# EAGLE design CNY70 (EAGLE 6.5.0)
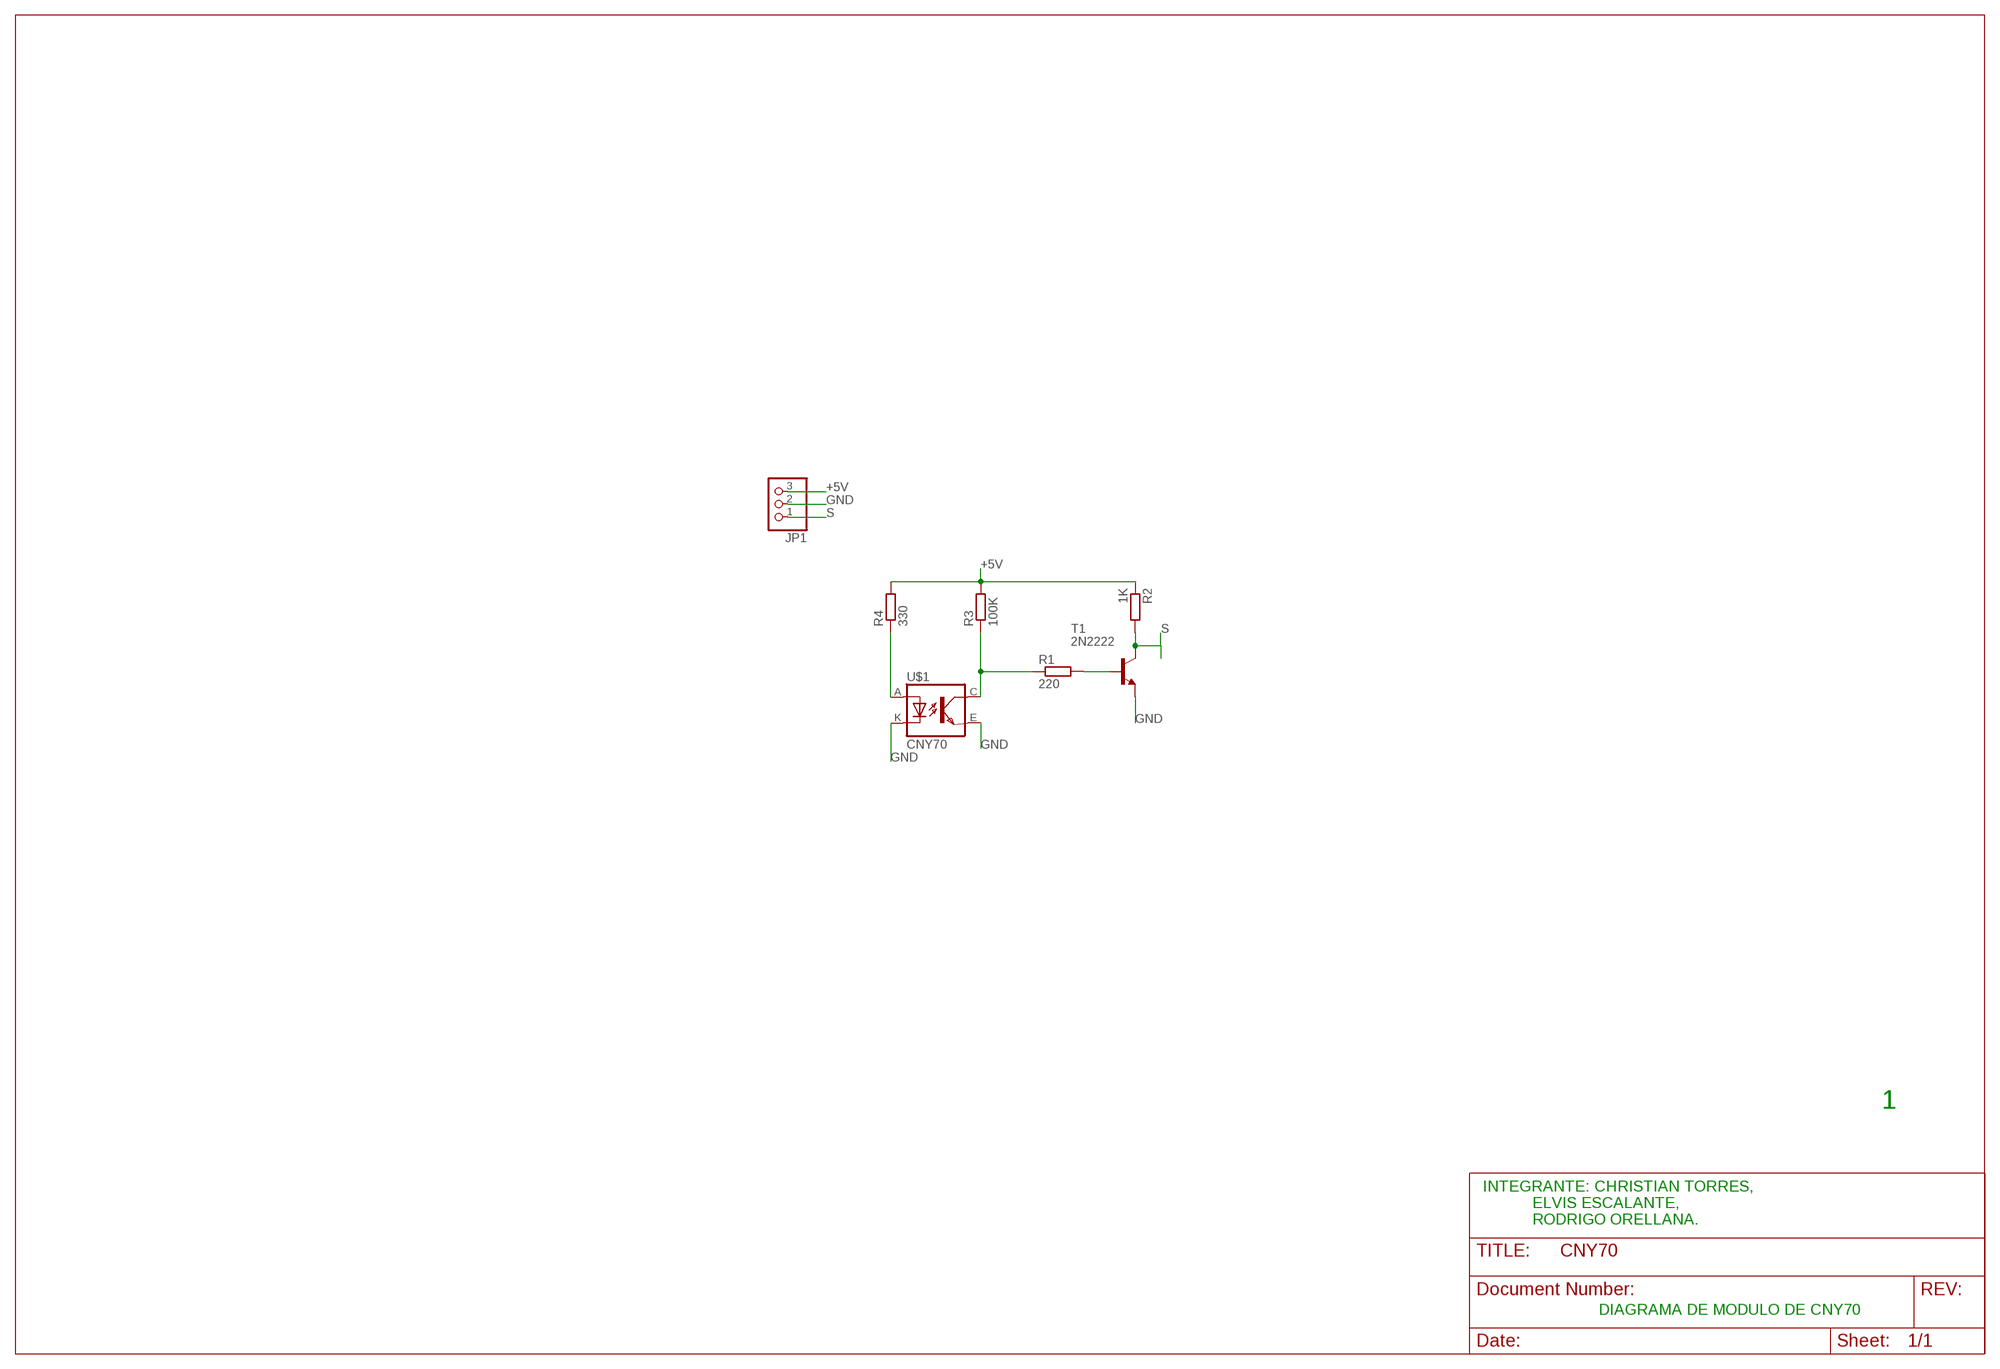
[diagram p0: schematic, sheet 1]

## Parts
JP1  PINHD-1X3  [1X03]
R1  220  R-EU_0207/12  [0207/12]
R2  1K  R-EU_0207/12  [0207/12]
R3  100K  R-EU_0207/12  [0207/12]
R4  330  R-EU_0207/12  [0207/12]
T1  2N2222  [TO92]
U$1  CNY70  [4]

## Nets
+5V: JP1.3 R2.1 R3.2 R4.2
GND: JP1.2 T1.3(E) U$1.E(EMI) U$1.K(C)
N$1: R4.1 U$1.A
N$2: R1.1 R3.1 U$1.C(COL)
N$3: R1.2 T1.1(B)
S: JP1.1 R2.2 T1.2(C)

## Notes on the sheet
- 1
- INTEGRANTE: CHRISTIAN TORRES, 
             ELVIS ESCALANTE,
             RODRIGO ORELLANA.
- DIAGRAMA DE MODULO DE CNY70

## Library data of the parts
JP1 = pinhead:PINHD-1X3: PIN HEADER
R1-R4 = rcl:R-EU_: RESISTOR, European symbol
T1 = transistor-neu92:2N2222: NPN TRANSISTOR
U$1 = cny70:CNY70

## Board
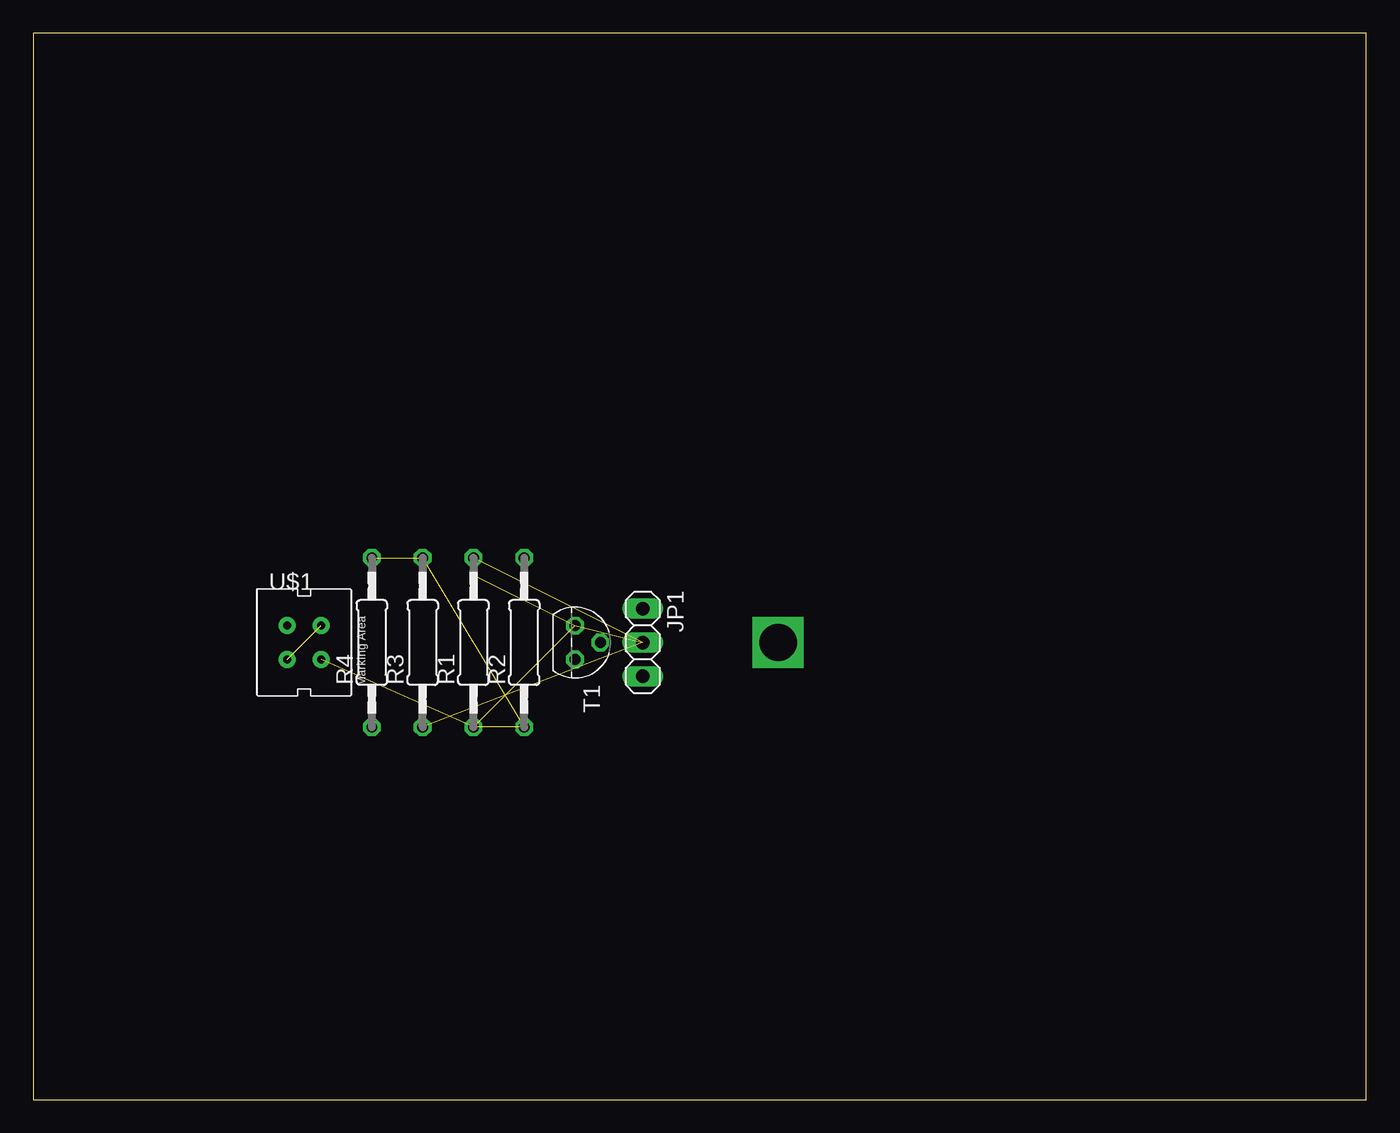
[diagram p1: board, top side]
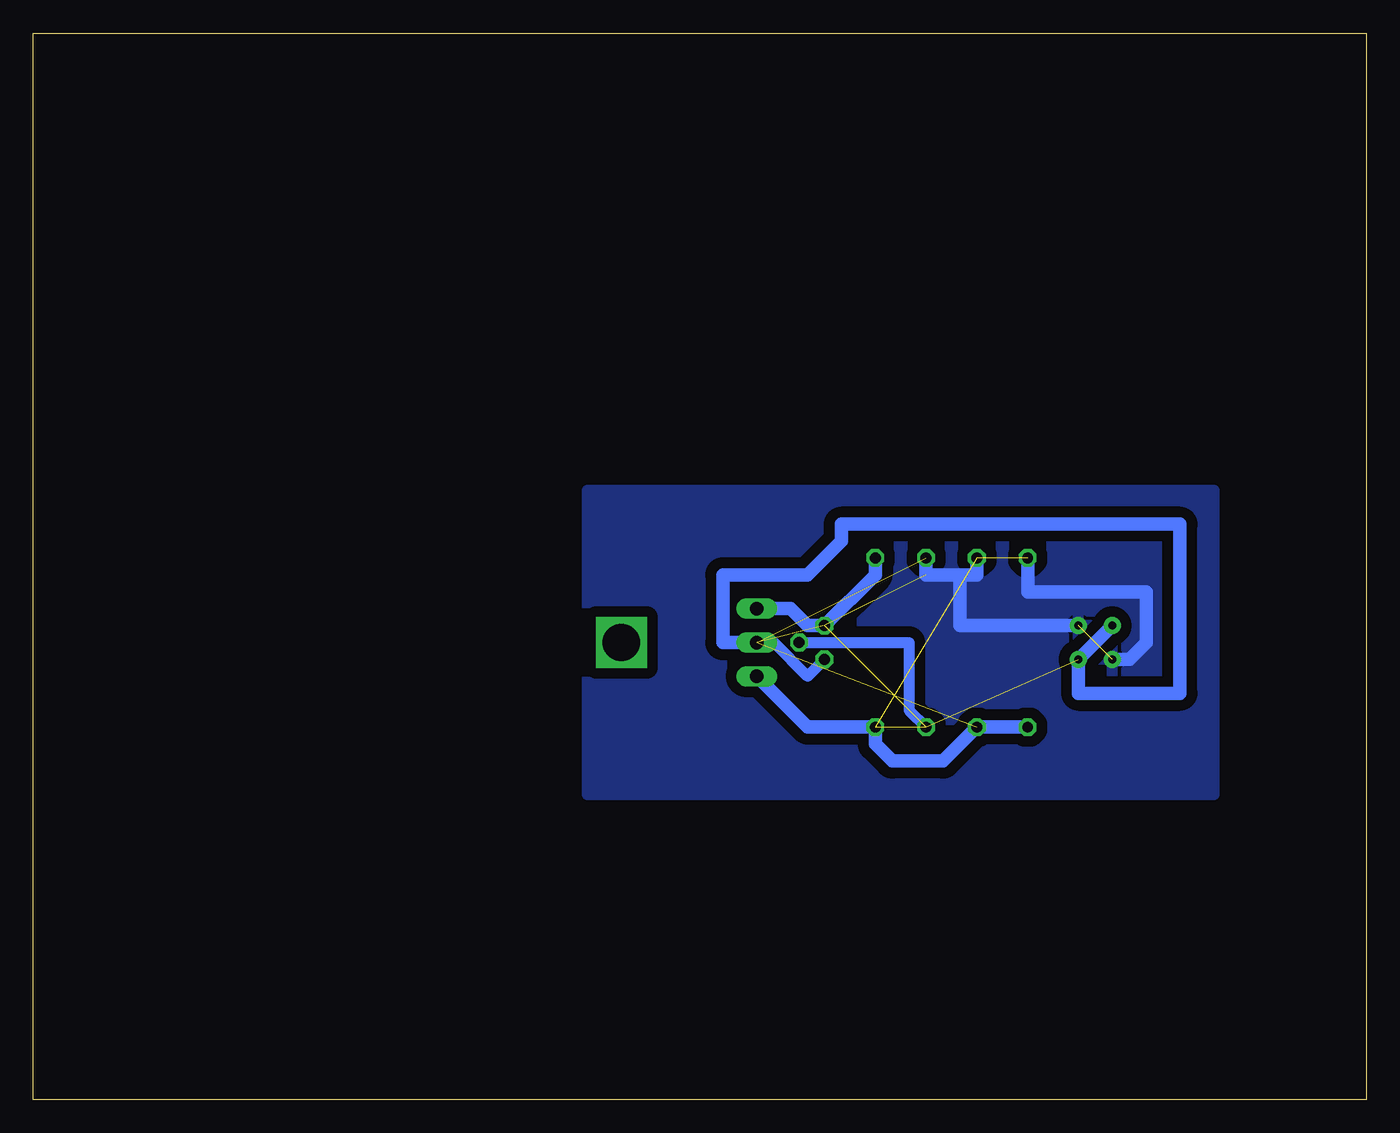
[diagram p2: board, bottom side, seen from below]

Size 100 x 80 mm. Coordinates in mm from the lower left corner, seen from the top.
Outline: 0,0 100,0 100,80 0,80 0,0
Copper layers (1*16): Top 0.035mm / dielectric 1.5mm / Bottom 0.035mm
Design rules "default": minimum track width 10mil, minimum drill 24mil, track to track 8mil, track to pad 8mil, pad to pad 8mil, via to via 8mil, smd to smd 8mil, copper to edge 40mil, drill to drill 8mil, minimum pad ring 10mil, minimum via ring 8mil, stop-mask expansion 4mil, vias tented up to drill 0mil, thermal gap 10mil

### Footprints (pad centres in the part's own frame; a part is rotated, then mirrored left to right if it is on the bottom)
1X03 = drill 1.016 long: 1 -2.54,0; 2 0,0; 3 2.54,0
0207/12 = drill 0.813 octagon: 1 -6.35,0; 2 6.35,0
TO92 = drill 0.813 octagon: 1 1.27,0; 2 0,1.905; 3 -1.27,0
4 = drill 0.61 pad 1.27: A -1.27,1.27; C 1.27,-1.27; E 1.27,1.27; K -1.27,-1.27

### Placement (x,y rotation side)
JP1  45.72,34.29 270 top
R1  33.02,34.29 90 top
R2  36.83,34.29 90 top
R3  29.21,34.29 90 top
R4  25.4,34.29 90 top
T1  40.64,34.29 270 top
U$1  20.32,34.29 0 top

### Tracks (layer width: path | path; a pad name or v marks a point on that pad's centre or on a via)
+5V  (2 unrouted)
  Bottom 1.016: JP1.3 41.91,27.94 R2.1
GND  (3 unrouted)
  Bottom 1.016: U$1.E 30.48,35.56 30.48,39.37 | 29.21,40.64 29.21,39.37 30.48,39.37 | 30.48,39.37 33.02,39.37 33.02,40.64 | U$1.K 17.78,33.02 16.51,34.29 16.51,38.1 25.4,38.1 25.4,40.64
  pour Bottom (isolate 0.813): 11.43,45.72 11.43,22.86 58.42,22.86 58.42,45.72
N$1  (1 unrouted)
  Bottom 1.016: U$1.A 21.59,33.02 21.59,30.48 13.97,30.48 13.97,43.18 39.37,43.18 39.37,41.91 41.91,39.37 48.26,39.37 48.26,34.29 45.72,34.29 | R4.1 29.21,27.94
N$2  (2 unrouted)
  Bottom 1.016: R3.1 31.75,25.4 35.56,25.4 36.83,26.67 36.83,27.94
N$3  (1 unrouted)
  Bottom 0.813: T1.1 41.91,31.75 44.45,34.29 45.72,34.29
N$4  (via drill 2.8)
  other vias: 55.88,34.29
S  (1 unrouted)
  Bottom 0.813: T1.2 34.29,34.29 34.29,29.21 33.02,27.94
  Bottom 1.016: R2.2 36.83,39.37 40.64,35.56 41.91,35.56 43.18,36.83 JP1.1